# EAGLE design WemosD1_Control (EAGLE 9.5.2)
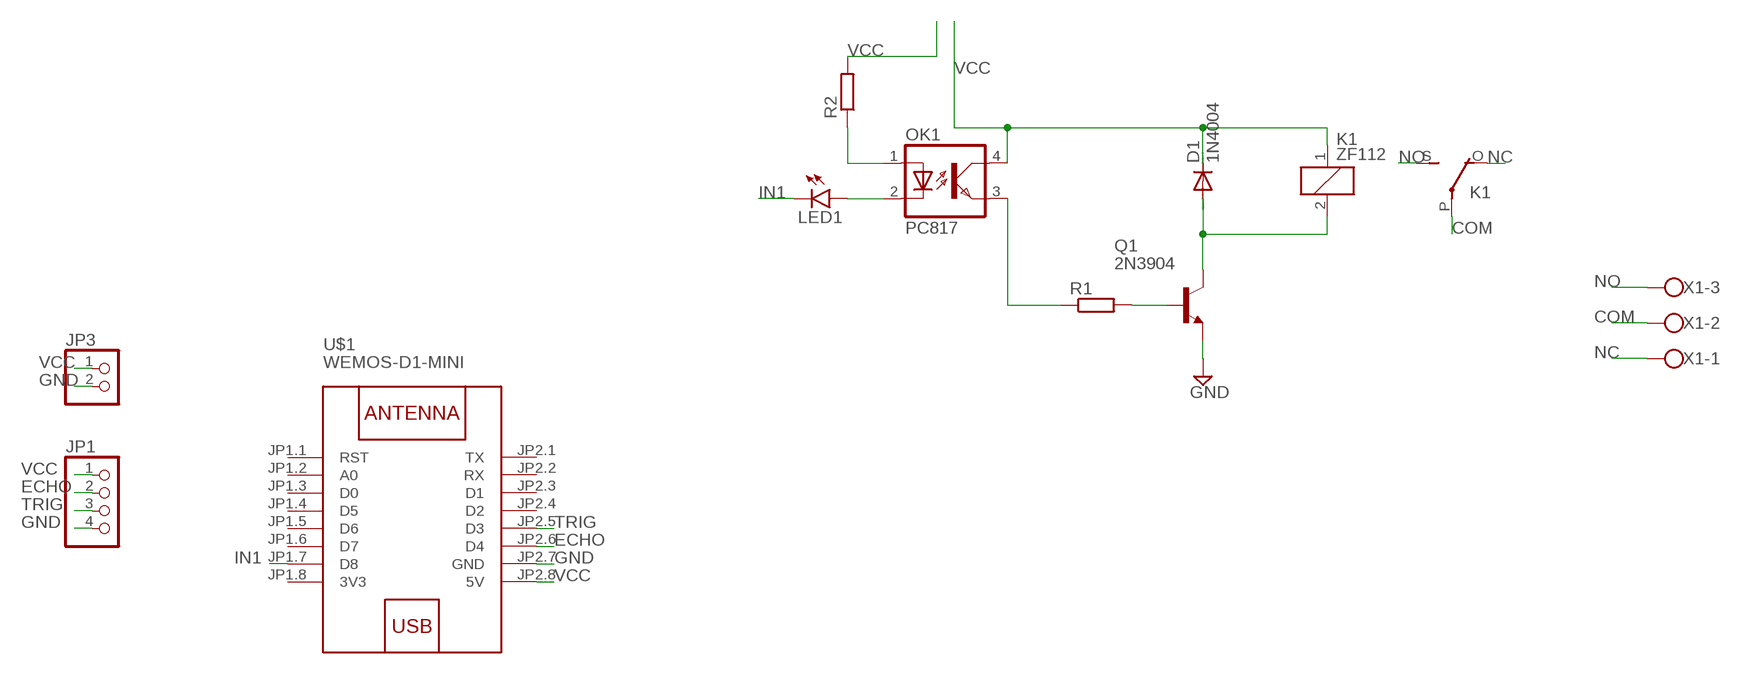
[diagram p0: schematic, sheet 1]

## Parts
D1  1N4004  [DO41-10]
JP1  PINHD-1X4  [1X04]
JP3  PINHD-1X2  [1X02]
K1  ZF112  [ZF112]
LED1  LED3MM  [LED3MM]
OK1  PC817  [DIL04]
Q1  2N3904  [TO92]
R1  R-EU_0204/7  [0204/7]
R2  R-EU_0204/7  [0204/7]
U$1  WEMOS-D1-MINI  [WEMOS-D1-MINI]
X1  W237-103  [W237-103]

## Nets
COM: K1.P(2:P) X1.2
ECHO: JP1.2 U$1.JP2.6(D4)
GND: JP1.4 JP3.2 Q1.3(E) U$1.JP2.7(GND)
IN1: LED1.K(C) U$1.JP1.7(D8)
N$1: D1.A K1.2 Q1.1(C)
N$7: OK1.3(EMIT) R1.1
N$8: Q1.2(B) R1.2
N$9: LED1.A OK1.2(C)
N$11: OK1.1(A) R2.1
NC: K1.O(2:O) X1.1
NO: K1.S(2:S) X1.3
TRIG: JP1.3 U$1.JP2.5(D3)
VCC: D1.C JP1.1 JP3.1 K1.1 OK1.4(COL) R2.2 U$1.JP2.8(5V)
Unconnected: U$1.JP1.1(RST) U$1.JP1.2(A0) U$1.JP1.3(D0) U$1.JP1.4(D5) U$1.JP1.5(D6) U$1.JP1.6(D7) U$1.JP2.1(TX) U$1.JP2.2(RX) U$1.JP2.3(D1) U$1.JP2.4(D2)

## Power pins joined to a net without a drawn wire
3V3: U$1.JP1.8(3V3)

## Library data of the parts
D1 = diode:1N4004: DIODE general purpose rectifier, 1 A
JP1 = pinhead:PINHD-1X4: PIN HEADER
JP3 = pinhead:PINHD-1X2: PIN HEADER
K1 = relay:ZF112: RELAY 1 x switch; OC_FARNELL: unknown; OC_NEWARK: unknown
LED1 = led:LED: LED OSRAM: - CHIPLED LG R971, LG N971, LY N971, LG Q971, LY Q971, LO R971, LY R971 LH N974, LH R974 LS Q976, LO Q976, LY Q976 LO Q996 - Hyper CHIPLED LW Q18S LB Q993, LB Q99A, LB R99A - SideLED LS A670, LO A670, LY A670, LG A670, LP A670 LB A673, LV A673, LT A673, LW A673 LH A674 LY A675 LS A676, LA A676, LO A676, LY A676, LW A676 LS A679, LY A679, LG A679 - Hyper Micro SIDELED® LS Y876, LA Y876, LO Y876, LY Y876 LT Y87S - SmartLED LW L88C, LW L88S LB L89C, LB L89S, LG L890 LS L89K, LO L89K, LY L89K LS L896, LA L896, LO L896, LY L896 - TOPLED LS T670, LO T670, LY T670, LG T670, LP T670 LSG T670, LSP T670, LSY T670, LOP T670, LYG T670 LG T671, LOG T671, LSG T671 LB T673, LV T673, LT T673, LW T673 LH T674 LS T676, LA T676, LO T676, LY T676, LB T676, LH T676, LSB T676, LW T676 LB T67C, LV T67C, LT T67C, LS T67K, LO T67K, LY T67K, LW E67C LS E67B, LA E67B, LO E67B, LY E67B, LB E67C, LV E67C, LT E67C LW T67C LS T679, LY T679, LG T679 LS T770, LO T770, LY T770, LG T770, LP T770 LB T773, LV T773, LT T773, LW T773 LH T774 LS E675, LA E675, LY E675, LS T675 LS T776, LA T776, LO T776, LY T776, LB T776 LHGB T686 LT T68C, LB T68C - Hyper Mini TOPLED® LB M676 - Mini TOPLED Santana® LG M470 LS M47K, LO M47K, LY M47K Source: http://www.osram.convergy.de LUXEON: - LUMILED® LXK2-PW12-R00, LXK2-PW12-S00, LXK2-PW14-U00, LXK2-PW14-V00 LXK2-PM12-R00, LXK2-PM12-S00, LXK2-PM14-U00 LXK2-PE12-Q00, LXK2-PE12-R00, LXK2-PE12-S00, LXK2-PE14-T00, LXK2-PE14-U00 LXK2-PB12-K00, LXK2-PB12-L00, LXK2-PB12-M00, LXK2-PB14-N00, LXK2-PB14-P00, LXK2-PB14-Q00 LXK2-PR12-L00, LXK2-PR12-M00, LXK2-PR14-Q00, LXK2-PR14-R00 LXK2-PD12-Q00, LXK2-PD12-R00, LXK2-PD12-S00 LXK2-PH12-R00, LXK2-PH12-S00 LXK2-PL12-P00, LXK2-PL12-Q00, LXK2-PL12-R00 Source: www.luxeon.com KINGBRIGHT: KA-3528ASYC Source: www.kingbright.com
OK1 = optocoupler:PC817: SHARP OPTO COUPLER; MPN: PC817X4J000F; OC_FARNELL: 9707727; OC_NEWARK: 97K7059
Q1 = transistor-npn:2N3904: NPN Transistor
R1 R2 = rcl:R-EU_: RESISTOR, European symbol; SPICEPREFIX: R
U$1 = diy-modules:WEMOS-D1-MINI: WEMOS D1 mini: Mini Wi-Fi Board based on ESP-8266 device More details can be found here: https://www.wemos.cc/product/d1-mini.html Click here to find device on ebay.com <http://www.ebay.com/sch/wemos+d1+mini+nodemcu>
X1 = con-wago-500:W237-103: WAGO SCREW CLAMP; MPN: 237-103; OC_FARNELL: unknown; OC_NEWARK: 18M7116

## Board
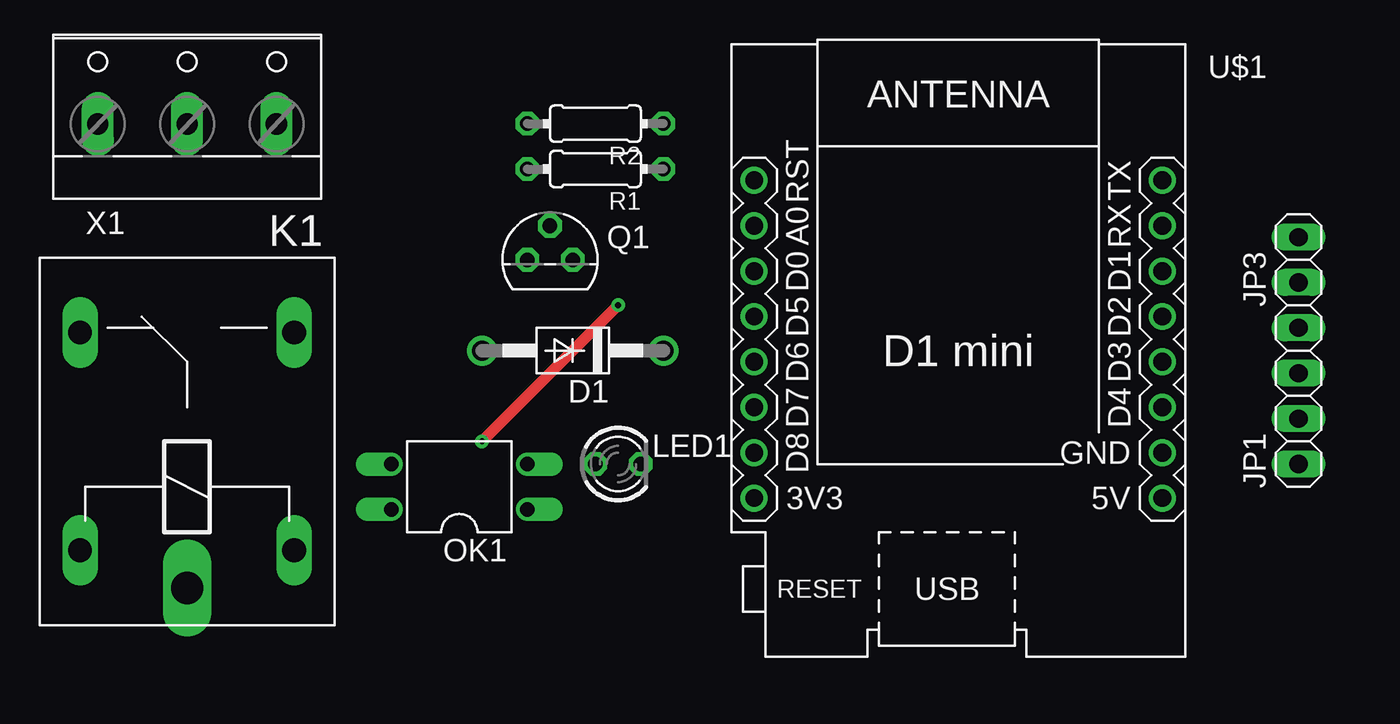
[diagram p1: board, top side]
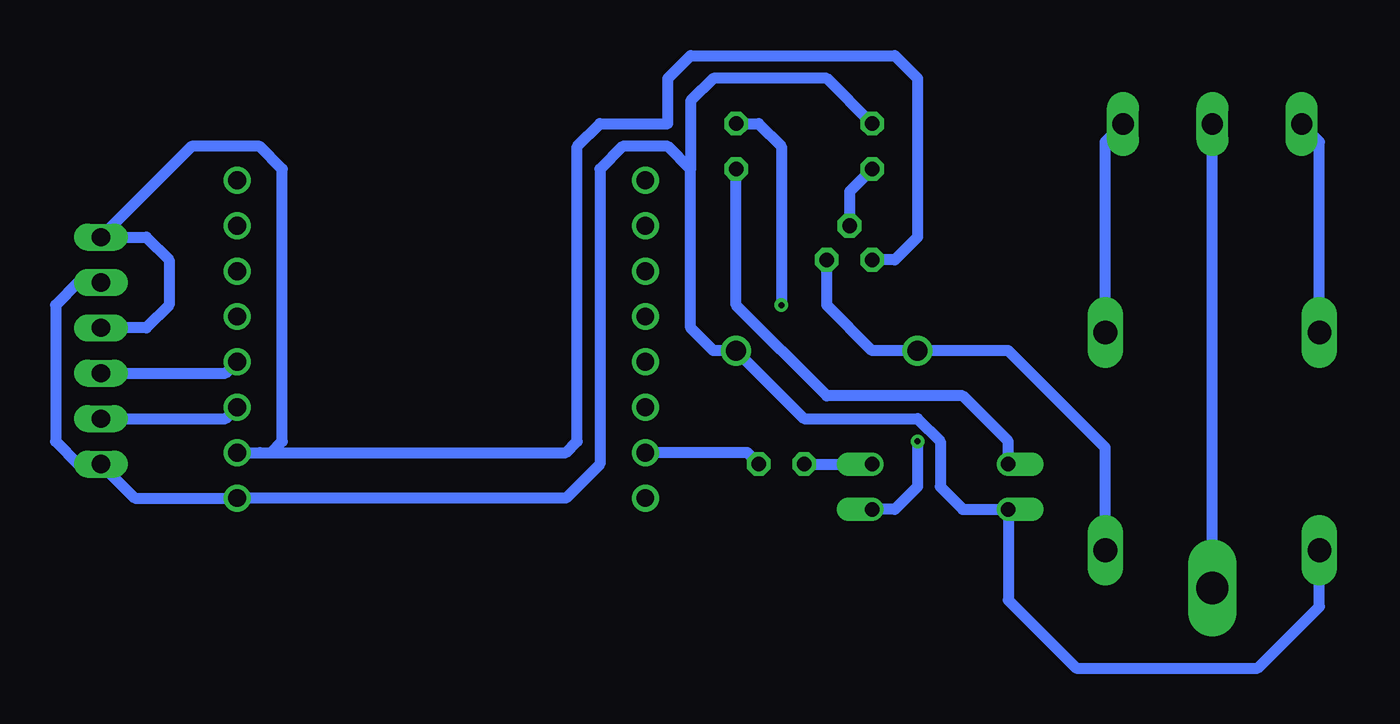
[diagram p2: board, bottom side, seen from below]

No outline drawn. Coordinates in mm, seen from the top.
Copper layers (1*16): Top 0.035mm / dielectric 1.5mm / Bottom 0.035mm
Design rules "default": minimum track width 6mil, minimum drill 0.35mm, track to track 6mil, track to pad 6mil, pad to pad 6mil, via to via 6mil, smd to smd 6mil, copper to edge 40mil, drill to drill 6mil, minimum pad ring 10mil, minimum via ring 8mil, stop-mask expansion 4mil, vias tented up to drill 0mil, thermal gap 10mil

### Footprints (pad centres in the part's own frame; a part is rotated, then mirrored left to right if it is on the bottom)
DO41-10 = drill 1.118: A 5.08,0; C -5.08,0
1X04 = drill 1.016 long: 1 -3.81,0; 2 -1.27,0; 3 1.27,0; 4 3.81,0
1X02 = drill 1.016 long: 1 -1.27,0; 2 1.27,0
ZF112 = drill 1.321 long: 1 -6.096,5.994; 2 -6.096,-5.994; O 6.096,5.994; S 6.096,-5.994 | drill 1.803 long: P -8.204,0
LED3MM = drill 0.813 octagon: A -1.27,0; K 1.27,0
DIL04 = drill 0.813 offset: 1 -1.27,-3.81; 2 1.27,-3.81; 3 1.27,3.81; 4 -1.27,3.81
TO92 = drill 0.813 octagon: 1 1.27,0; 2 0,1.905; 3 -1.27,0
0204/7 = drill 0.813 octagon: 1 -3.81,0; 2 3.81,0
WEMOS-D1-MINI = drill 1: JP1.1 -11.43,9.525; JP1.2 -11.43,6.985; JP1.3 -11.43,4.445; JP1.4 -11.43,1.905; JP1.5 -11.43,-0.635; JP1.6 -11.43,-3.175; JP1.7 -11.43,-5.715; JP1.8 -11.43,-8.255; JP2.1 11.43,9.525; JP2.2 11.43,6.985; JP2.3 11.43,4.445; JP2.4 11.43,1.905; JP2.5 11.43,-0.635; JP2.6 11.43,-3.175; JP2.7 11.43,-5.715; JP2.8 11.43,-8.255
W237-103 = drill 1.194 long: 1 -5,-1.29; 2 0,-1.29; 3 5,-1.29

### Placement (x,y rotation side)
D1  33.02,45.72 180 top
JP1  73.66,43.18 90 top
JP3  73.66,50.8 90 top
K1  11.43,40.64 90 top
LED1  35.56,39.37 0 top
OK1  26.67,38.1 90 top
Q1  31.75,50.8 0 top
R1  34.29,55.88 180 top
R2  34.29,58.42 180 top
U$1  54.61,45.72 0 top
X1  11.43,59.69 0 top

### Tracks (layer width: path | path; a pad name or v marks a point on that pad's centre or on a via)
COM
  Bottom 0.61: K1.P X1.2
ECHO
  Bottom 0.61: JP1.2 66.67,41.91 U$1.JP2.6
GND
  Bottom 0.61: JP1.4 71.12,46.99 69.85,48.26 69.85,50.8 71.12,52.07 JP3.2 68.58,57.15 64.77,57.15 63.5,55.88 63.5,40.64 64.14,40.01 | U$1.JP2.7 64.77,40.01 64.14,40.01 | 64.14,40.01 47.62,40.01 46.99,40.64 46.99,57.15 45.72,58.42 41.91,58.42 41.91,60.96 40.64,62.23 29.21,62.23 27.94,60.96 27.94,52.07 29.21,50.8 Q1.3
IN1
  Bottom 0.61: LED1.K 37.47,40.01 U$1.JP1.7
N$1
  Bottom 0.61: K1.2 17.42,40.28 22.86,45.72 D1.A 30.48,45.72 33.02,48.26 Q1.1
N$7
  Bottom 0.61: OK1.3 22.86,40.64 25.4,43.18 33.02,43.18 38.1,48.26 R1.1
N$8
  Bottom 0.61: R1.2 31.75,54.61 Q1.2
N$9
  Bottom 0.61: LED1.A OK1.2
N$11  (via drill 0.35)
  Top 0.61: v35.56,48.26 v27.94,40.64
  Bottom 0.61: R2.1 36.83,58.42 35.56,57.15 v35.56,48.26 | v27.94,40.64 27.94,38.1 29.21,36.83 OK1.1
NC
  Bottom 0.61: K1.O 5.44,57.41 X1.1
NO
  Bottom 0.61: K1.S 17.42,57.41 X1.3
TRIG
  Bottom 0.61: JP1.3 66.67,44.45 U$1.JP2.5
VCC
  Bottom 0.61: K1.1 5.44,31.39 8.89,27.94 19.05,27.94 22.86,31.75 OK1.4 25.4,36.83 26.67,38.1 26.67,40.64 27.94,41.91 34.29,41.91 D1.C 39.37,45.72 40.64,46.99 40.64,55.88 | JP3.1 74.93,49.53 76.2,48.26 76.2,40.64 74.93,39.37 JP1.1 71.75,37.47 U$1.JP2.8 47.62,37.47 45.72,39.37 45.72,55.88 44.45,57.15 41.91,57.15 40.64,55.88 | R2.2 33.02,60.96 39.37,60.96 40.64,59.69 40.64,55.88